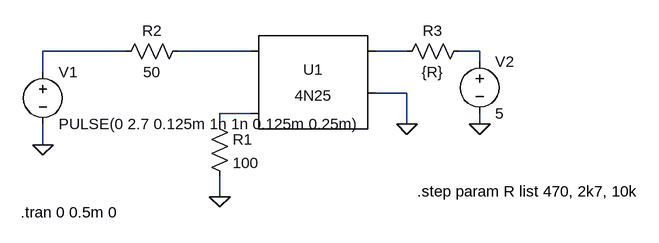
[diagram p0: schematic optp-tprop.asc]
optp-tprop.asc, the LTspice schematic file:
Version 4
SHEET 1 880 680
WIRE -32 80 -160 80
WIRE 160 80 48 80
WIRE 400 80 352 80
WIRE 512 80 480 80
WIRE 512 96 512 80
WIRE -160 112 -160 80
WIRE 400 144 352 144
WIRE 160 176 112 176
WIRE 112 192 112 176
WIRE 400 192 400 144
WIRE 512 192 512 176
WIRE -160 224 -160 192
WIRE 112 304 112 272
FLAG -160 224 0
FLAG 400 192 0
FLAG 512 192 0
FLAG 112 304 0
SYMBOL Optos\\4N25 256 144 R0
SYMATTR InstName U1
SYMBOL voltage -160 96 R0
WINDOW 123 0 0 Left 0
WINDOW 39 0 0 Left 0
SYMATTR InstName V1
SYMATTR Value PULSE(0 2.7 0.125m 1n 1n 0.125m 0.25m)
SYMBOL voltage 512 80 R0
WINDOW 123 0 0 Left 0
WINDOW 39 0 0 Left 0
SYMATTR InstName V2
SYMATTR Value 5
SYMBOL res 64 64 R90
WINDOW 0 0 56 VBottom 2
WINDOW 3 32 56 VTop 2
SYMATTR InstName R2
SYMATTR Value 50
SYMBOL res 96 176 R0
SYMATTR InstName R1
SYMATTR Value 100
SYMBOL res 496 64 R90
WINDOW 0 0 56 VBottom 2
WINDOW 3 32 56 VTop 2
SYMATTR InstName R3
SYMATTR Value {R}
TEXT 416 296 Left 2 !.step param R list 470, 2k7, 10k
TEXT -194 328 Left 2 !.tran 0 0.5m 0

The netlist it stands for:
* optp-tprop.asc
XU1 N002 N005 N003 0 NC_01 4N25
V1 N001 0 PULSE(0 2.7 0.125m 1n 1n 0.125m 0.25m)
V2 N004 0 5
R2 N002 N001 50
R1 N005 0 100
R3 N004 N003 {R}
.step param R list 470, 2k7, 10k
.tran 0 0.5m 0
.lib 4N25.sub
.backanno
.end